# Altium schematic sheet LVDS.SchDoc
size A3; SheetNumber: 18; SheetTotal: 23
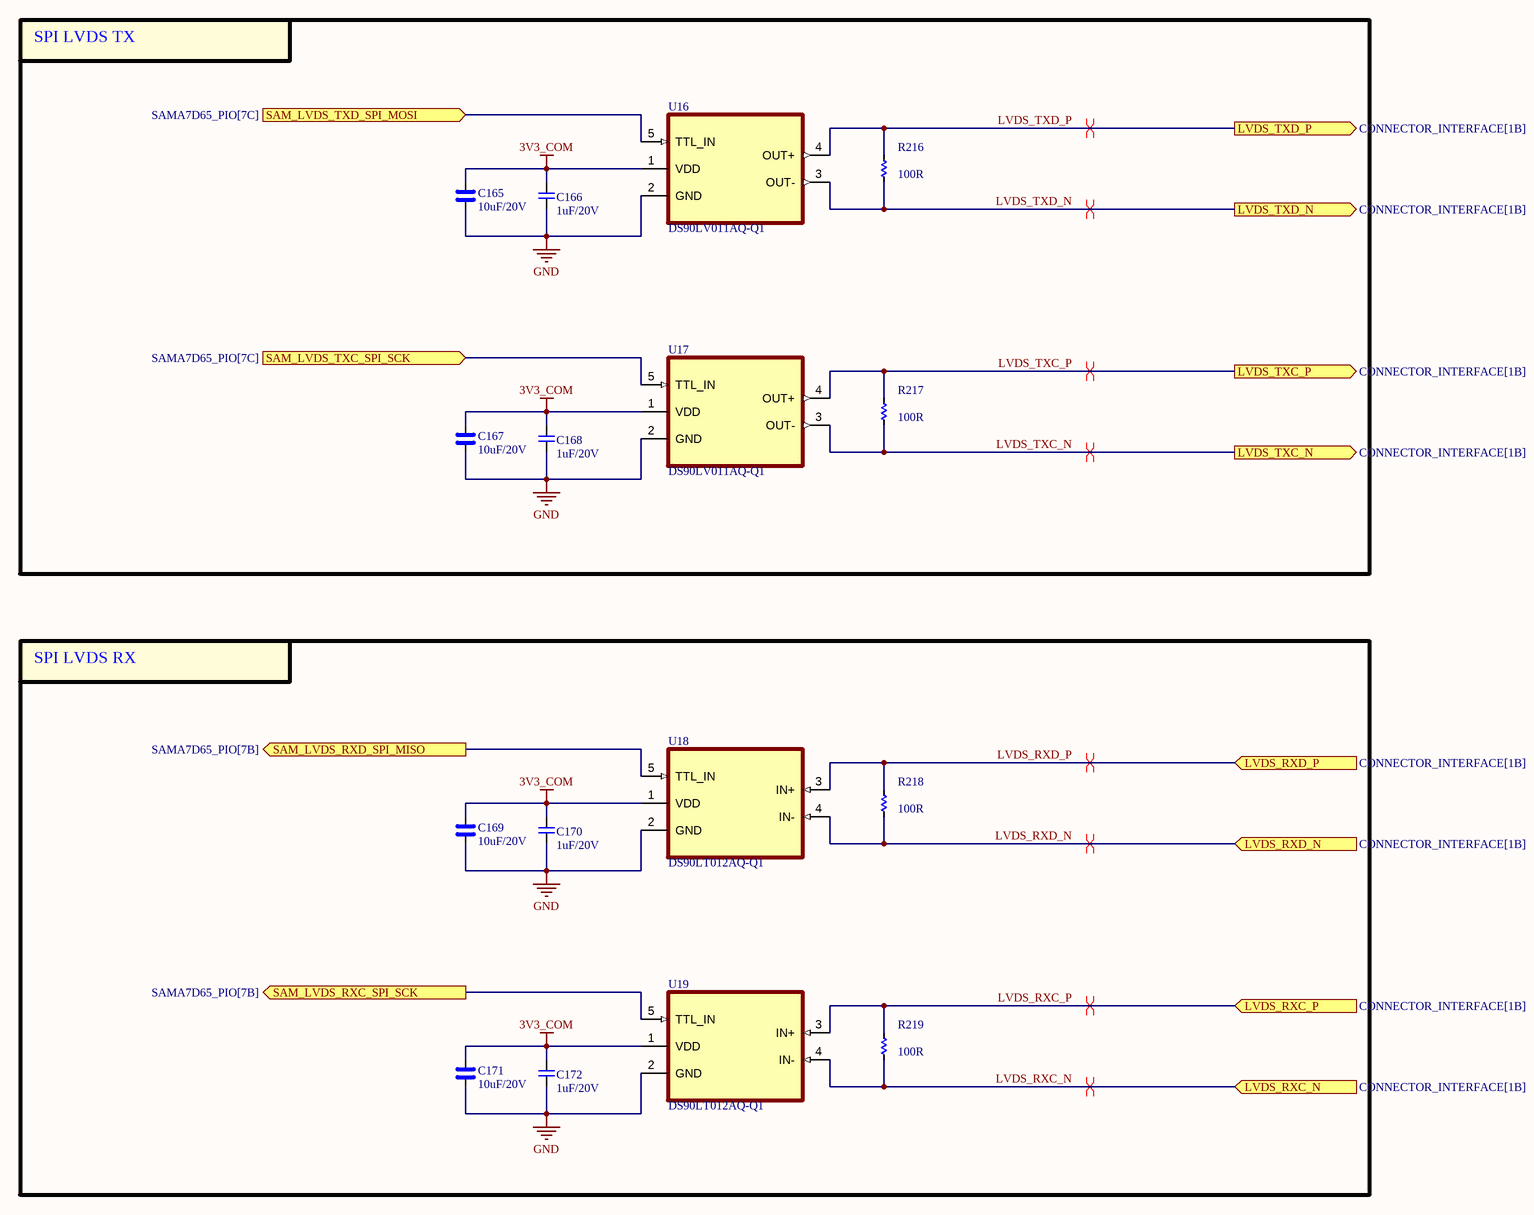
[diagram p0: LVDS.SchDoc]

## Parts
C165  10uF/20V  [CAP_C_2012X110]
C166  1uF/20V  [CAP_C_1005X50_L]
C167  10uF/20V  [CAP_C_2012X110]
C168  1uF/20V  [CAP_C_1005X50_L]
C169  10uF/20V  [CAP_C_2012X110]
C170  1uF/20V  [CAP_C_1005X50_L]
C171  10uF/20V  [CAP_C_2012X110]
C172  1uF/20V  [CAP_C_1005X50_L]
R216  100R  [RES_C_1005x30_L]
R217  100R  [RES_C_1005x30_L]
R218  100R  [RES_C_1005x30_L]
R219  100R  [RES_C_1005x30_L]
U16  DS90LV011AQ-Q1  [DS90LV011AQ-Q1]
U17  DS90LV011AQ-Q1  [DS90LV011AQ-Q1]
U18  DS90LT012AQ-Q1  [DS90LV011AQ-Q1]
U19  DS90LT012AQ-Q1  [DS90LV011AQ-Q1]

## Blocks framed on the sheet
SPI LVDS TX: C165-C168 R216 R217 U16 U17
SPI LVDS RX: C169-C172 R218 R219 U18 U19

## Ports
LVDS_RXC_N (in, see CONNECTOR_INTERFACE[1B]), LVDS_RXC_P (in, see CONNECTOR_INTERFACE[1B]), LVDS_RXD_N (in, see CONNECTOR_INTERFACE[1B]), LVDS_RXD_P (in, see CONNECTOR_INTERFACE[1B]), LVDS_TXC_N (out, see CONNECTOR_INTERFACE[1B]), LVDS_TXC_P (out, see CONNECTOR_INTERFACE[1B]), LVDS_TXD_N (out, see CONNECTOR_INTERFACE[1B]), LVDS_TXD_P (out, see CONNECTOR_INTERFACE[1B]), SAM_LVDS_RXC_SPI_SCK (out, see SAMA7D65_PIO[7B]), SAM_LVDS_RXD_SPI_MISO (out, see SAMA7D65_PIO[7B]), SAM_LVDS_TXC_SPI_SCK (in, see SAMA7D65_PIO[7C]), SAM_LVDS_TXD_SPI_MOSI (in, see SAMA7D65_PIO[7C])

## Nets
3V3_COM: C165.2 C166.2 C167.2 C168.2 C169.2 C170.2 C171.2 C172.2 U16.1(VDD) U17.1(VDD) U18.1(VDD) U19.1(VDD)
GND: C165.1 C166.1 C167.1 C168.1 C169.1 C170.1 C171.1 C172.1 U16.2(GND) U17.2(GND) U18.2(GND) U19.2(GND)
LVDS_RXC_N: R219.2 U19.4(IN-) ; port LVDS_RXC_N
LVDS_RXC_P: R219.1 U19.3(IN+) ; port LVDS_RXC_P
LVDS_RXD_N: R218.2 U18.4(IN-) ; port LVDS_RXD_N
LVDS_RXD_P: R218.1 U18.3(IN+) ; port LVDS_RXD_P
LVDS_TXC_N: R217.2 U17.3(OUT-) ; port LVDS_TXC_N
LVDS_TXC_P: R217.1 U17.4(OUT+) ; port LVDS_TXC_P
LVDS_TXD_N: R216.2 U16.3(OUT-) ; port LVDS_TXD_N
LVDS_TXD_P: R216.1 U16.4(OUT+) ; port LVDS_TXD_P
SAM_LVDS_RXC_SPI_SCK: U19.5(TTL_IN) ; port SAM_LVDS_RXC_SPI_SCK
SAM_LVDS_RXD_SPI_MISO: U18.5(TTL_IN) ; port SAM_LVDS_RXD_SPI_MISO
SAM_LVDS_TXC_SPI_SCK: U17.5(TTL_IN) ; port SAM_LVDS_TXC_SPI_SCK
SAM_LVDS_TXD_SPI_MOSI: U16.5(TTL_IN) ; port SAM_LVDS_TXD_SPI_MOSI

## Layout directives
differential pair: LVDS_RXC_N, LVDS_RXC_P, LVDS_RXD_N, LVDS_RXD_P, LVDS_TXC_N, LVDS_TXC_P, LVDS_TXD_N, LVDS_TXD_P

## Notes on the sheet
- Project:
- Page Contents:
- Revision:
- Design:
- Date:
- Size:
- A3
- Document Number:
- Sheet:
- of

## Library data of the parts
C165 C167 C169 C171 = _CAP_C_High_2: CAP CHIP High Value
C166 C168 C170 C172 = _CAP_C_2: CAP CHIP
R216-R219 = _RES_B_2: RES
U16 U17 = DS90LV011AQ-Q1: Automotive LVDS Differential Driver
U18 U19 = DS90LT012AQ-Q1: Automotive LVDS Differential Line Receiver